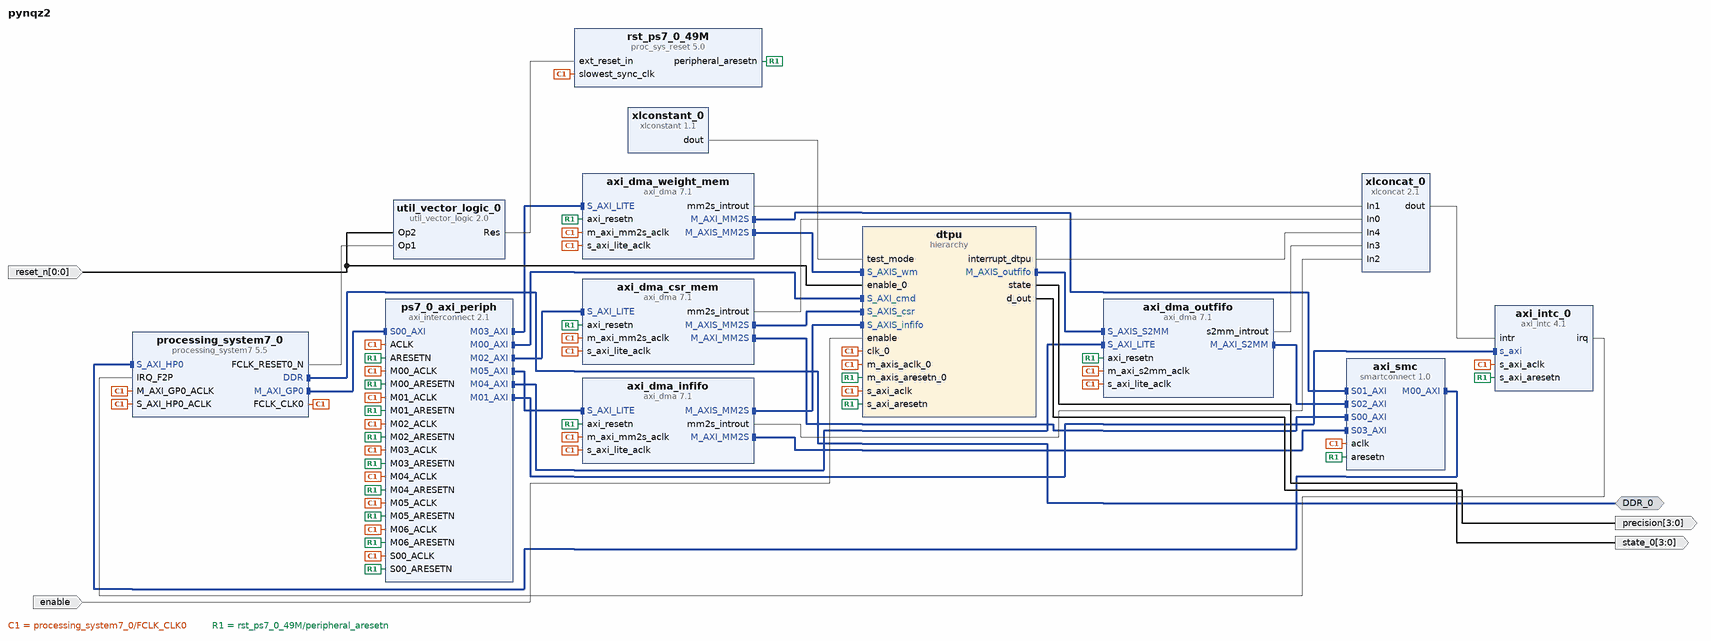
[diagram p0: block diagram of the top level]
# Vivado block design pynqz2, xc7z020clg400-1, Vivado 2019.2
create_bd_design pynqz2

create_bd_intf_port -mode Master -vlnv xilinx.com:interface:ddrx_rtl:1.0 DDR_0
create_bd_port -dir O -from 3 -to 0 state_0
create_bd_port -dir O -from 3 -to 0 precision
create_bd_port -dir I enable
create_bd_port -dir I -from 0 -to 0 reset_n

create_bd_cell -type ip -vlnv xilinx.com:ip:processing_system7:5.5 processing_system7_0
set_property -dict [list \
  CONFIG.PCW_APU_PERIPHERAL_FREQMHZ 650 \
  CONFIG.PCW_CRYSTAL_PERIPHERAL_FREQMHZ 50 \
  CONFIG.PCW_ENET0_ENET0_IO {MIO 16 .. 27} \
  CONFIG.PCW_ENET0_GRP_MDIO_ENABLE 1 \
  CONFIG.PCW_ENET0_GRP_MDIO_IO {MIO 52 .. 53} \
  CONFIG.PCW_ENET0_PERIPHERAL_ENABLE 1 \
  CONFIG.PCW_ENET0_RESET_ENABLE 1 \
  CONFIG.PCW_ENET0_RESET_IO {MIO 9} \
  CONFIG.PCW_ENET_RESET_ENABLE 1 \
  CONFIG.PCW_ENET_RESET_SELECT {Share reset pin} \
  CONFIG.PCW_FCLK_CLK0_BUF FALSE \
  CONFIG.PCW_FPGA0_PERIPHERAL_FREQMHZ 30 \
  CONFIG.PCW_FPGA1_PERIPHERAL_FREQMHZ 10 \
  CONFIG.PCW_FPGA2_PERIPHERAL_FREQMHZ 200 \
  CONFIG.PCW_FPGA3_PERIPHERAL_FREQMHZ 166.67 \
  CONFIG.PCW_GPIO_MIO_GPIO_ENABLE 1 \
  CONFIG.PCW_GPIO_MIO_GPIO_IO MIO \
  CONFIG.PCW_I2C_RESET_ENABLE 1 \
  CONFIG.PCW_IRQ_F2P_INTR 1 \
  CONFIG.PCW_PERIPHERAL_BOARD_PRESET part0 \
  CONFIG.PCW_PRESET_BANK1_VOLTAGE {LVCMOS 1.8V} \
  CONFIG.PCW_QSPI_GRP_FBCLK_ENABLE 1 \
  CONFIG.PCW_QSPI_GRP_FBCLK_IO {MIO 8} \
  CONFIG.PCW_QSPI_GRP_SINGLE_SS_ENABLE 1 \
  CONFIG.PCW_QSPI_GRP_SINGLE_SS_IO {MIO 1 .. 6} \
  CONFIG.PCW_QSPI_PERIPHERAL_ENABLE 1 \
  CONFIG.PCW_QSPI_QSPI_IO {MIO 1 .. 6} \
  CONFIG.PCW_SD0_GRP_CD_ENABLE 1 \
  CONFIG.PCW_SD0_GRP_CD_IO {MIO 47} \
  CONFIG.PCW_SD0_GRP_WP_ENABLE 0 \
  CONFIG.PCW_SD0_PERIPHERAL_ENABLE 1 \
  CONFIG.PCW_SD0_SD0_IO {MIO 40 .. 45} \
  CONFIG.PCW_SDIO_PERIPHERAL_FREQMHZ 50 \
  CONFIG.PCW_SINGLE_QSPI_DATA_MODE x4 \
  CONFIG.PCW_TTC0_PERIPHERAL_ENABLE 1 \
  CONFIG.PCW_TTC0_TTC0_IO EMIO \
  CONFIG.PCW_UART0_PERIPHERAL_ENABLE 1 \
  CONFIG.PCW_UART0_UART0_IO {MIO 14 .. 15} \
  CONFIG.PCW_UART1_PERIPHERAL_ENABLE 0 \
  CONFIG.PCW_UART_PERIPHERAL_FREQMHZ 100 \
  CONFIG.PCW_UIPARAM_DDR_BUS_WIDTH {16 Bit} \
  CONFIG.PCW_UIPARAM_DDR_FREQ_MHZ 525 \
  CONFIG.PCW_UIPARAM_DDR_PARTNO {MT41J256M16 RE-125} \
  CONFIG.PCW_USB0_PERIPHERAL_ENABLE 1 \
  CONFIG.PCW_USB0_RESET_ENABLE 1 \
  CONFIG.PCW_USB0_RESET_IO {MIO 46} \
  CONFIG.PCW_USB0_USB0_IO {MIO 28 .. 39} \
  CONFIG.PCW_USB_RESET_ENABLE 1 \
  CONFIG.PCW_USB_RESET_SELECT {Share reset pin} \
  CONFIG.PCW_USE_FABRIC_INTERRUPT 1 \
  CONFIG.PCW_USE_S_AXI_HP0 1 \
] [get_bd_cells processing_system7_0]
# 510 more settings of processing_system7_0 are not shown: defaults, MIO pin electricals, DDR timing, and values the tool derives
create_bd_cell -type ip -vlnv xilinx.com:ip:proc_sys_reset:5.0 rst_ps7_0_49M
create_bd_cell -type ip -vlnv xilinx.com:ip:xlconcat:2.1 xlconcat_0
set_property -dict {CONFIG.NUM_PORTS 5} [get_bd_cells xlconcat_0]
create_bd_cell -type hier dtpu
create_bd_cell -type ip -vlnv xilinx.com:ip:util_vector_logic:2.0 util_vector_logic_0
set_property -dict {CONFIG.C_SIZE 1} [get_bd_cells util_vector_logic_0]
create_bd_cell -type ip -vlnv xilinx.com:ip:axi_dma:7.1 axi_dma_csr_mem
set_property -dict [list \
  CONFIG.c_include_mm2s_dre 1 \
  CONFIG.c_include_s2mm 0 \
  CONFIG.c_include_sg 0 \
  CONFIG.c_m_axi_mm2s_data_width 64 \
  CONFIG.c_m_axis_mm2s_tdata_width 64 \
  CONFIG.c_mm2s_burst_size 8 \
  CONFIG.c_sg_length_width 26 \
] [get_bd_cells axi_dma_csr_mem]
create_bd_cell -type ip -vlnv xilinx.com:ip:axi_intc:4.1 axi_intc_0
set_property -dict {CONFIG.C_IRQ_CONNECTION 1} [get_bd_cells axi_intc_0]
create_bd_cell -type ip -vlnv xilinx.com:ip:smartconnect:1.0 axi_smc
set_property -dict {CONFIG.NUM_MI 1 CONFIG.NUM_SI 4} [get_bd_cells axi_smc]
create_bd_cell -type ip -vlnv xilinx.com:ip:axi_interconnect:2.1 ps7_0_axi_periph
set_property -dict {CONFIG.NUM_MI 7} [get_bd_cells ps7_0_axi_periph]
create_bd_cell -type ip -vlnv xilinx.com:ip:xlconstant:1.1 xlconstant_0
set_property -dict {CONFIG.CONST_VAL 0} [get_bd_cells xlconstant_0]
create_bd_cell -type ip -vlnv xilinx.com:ip:axi_dma:7.1 axi_dma_weight_mem
set_property -dict [list \
  CONFIG.c_include_mm2s_dre 1 \
  CONFIG.c_include_s2mm 0 \
  CONFIG.c_include_sg 0 \
  CONFIG.c_m_axi_mm2s_data_width 64 \
  CONFIG.c_m_axis_mm2s_tdata_width 64 \
  CONFIG.c_mm2s_burst_size 8 \
  CONFIG.c_sg_length_width 26 \
] [get_bd_cells axi_dma_weight_mem]
create_bd_cell -type ip -vlnv xilinx.com:ip:axi_dma:7.1 axi_dma_outfifo
set_property -dict [list \
  CONFIG.c_include_mm2s 0 \
  CONFIG.c_include_s2mm_dre 1 \
  CONFIG.c_include_sg 0 \
  CONFIG.c_sg_length_width 20 \
] [get_bd_cells axi_dma_outfifo]
create_bd_cell -type ip -vlnv xilinx.com:ip:axi_dma:7.1 axi_dma_infifo
set_property -dict [list \
  CONFIG.c_include_mm2s_dre 1 \
  CONFIG.c_include_s2mm 0 \
  CONFIG.c_include_sg 0 \
  CONFIG.c_m_axi_mm2s_data_width 64 \
  CONFIG.c_m_axis_mm2s_tdata_width 64 \
  CONFIG.c_mm2s_burst_size 8 \
  CONFIG.c_sg_length_width 20 \
] [get_bd_cells axi_dma_infifo]

# ---- hierarchy /dtpu ----
current_bd_instance /dtpu
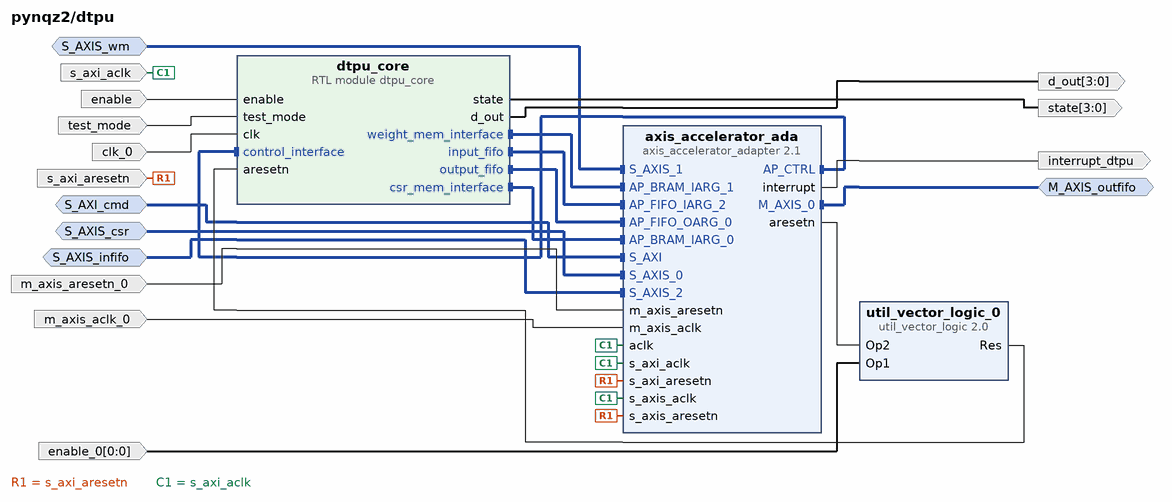
[diagram p1: block diagram inside /dtpu]
create_bd_intf_pin -mode Slave -vlnv xilinx.com:interface:axis_rtl:1.0 S_AXIS_infifo
create_bd_intf_pin -mode Slave -vlnv xilinx.com:interface:axis_rtl:1.0 S_AXIS_wm
create_bd_intf_pin -mode Slave -vlnv xilinx.com:interface:axis_rtl:1.0 S_AXIS_csr
create_bd_intf_pin -mode Master -vlnv xilinx.com:interface:axis_rtl:1.0 M_AXIS_outfifo
create_bd_intf_pin -mode Slave -vlnv xilinx.com:interface:aximm_rtl:1.0 S_AXI_cmd
create_bd_pin -dir O -from 3 -to 0 state
create_bd_pin -dir O -from 3 -to 0 d_out
create_bd_pin -dir I enable
create_bd_pin -dir I test_mode
create_bd_pin -dir I -from 0 -to 0 enable_0
create_bd_pin -dir I -type clk clk_0
create_bd_pin -dir O -type intr interrupt_dtpu
create_bd_pin -dir I -type rst s_axi_aresetn
create_bd_pin -dir I -type clk s_axi_aclk
create_bd_pin -dir I -type rst m_axis_aresetn_0
create_bd_pin -dir I -type clk m_axis_aclk_0

create_bd_cell -type ip -vlnv xilinx.com:ip:util_vector_logic:2.0 util_vector_logic_0
set_property -dict {CONFIG.C_SIZE 1} [get_bd_cells util_vector_logic_0]
create_bd_cell -type module -reference dtpu_core dtpu_core
set_property -dict {CONFIG.COLUMNS 8 CONFIG.DATA_WIDTH_CSR 64 CONFIG.ROWS 8 CONFIG.SIZE_WMEMORY 16384} [get_bd_cells dtpu_core]
create_bd_cell -type ip -vlnv xilinx.com:ip:axis_accelerator_adapter:2.1 axis_accelerator_ada
set_property -dict [list \
  CONFIG.C_AP_ADAPTER_ID 0 \
  CONFIG.C_AP_IARG_0_DWIDTH 64 \
  CONFIG.C_AP_IARG_0_MB_DEPTH 2 \
  CONFIG.C_AP_IARG_1_DIM_1 16384 \
  CONFIG.C_AP_IARG_1_DWIDTH 64 \
  CONFIG.C_AP_IARG_1_MB_DEPTH 2 \
  CONFIG.C_AP_IARG_2_DIM_1 2048 \
  CONFIG.C_AP_IARG_2_DWIDTH 64 \
  CONFIG.C_AP_IARG_2_TYPE 1 \
  CONFIG.C_AP_OARG_0_DIM_1 2048 \
  CONFIG.C_AP_OARG_0_DWIDTH 64 \
  CONFIG.C_AP_OARG_0_TYPE 1 \
  CONFIG.C_IARG_HAS_BRAM 1 \
  CONFIG.C_IARG_HAS_FIFO 1 \
  CONFIG.C_M_AXIS_HAS_TKEEP 1 \
  CONFIG.C_M_AXIS_TDEST_WIDTH 0 \
  CONFIG.C_M_AXIS_TID_WIDTH 0 \
  CONFIG.C_M_AXIS_TUSER_WIDTH 0 \
  CONFIG.C_N_INPUT_ARGS 3 \
  CONFIG.C_OARG_HAS_BRAM 0 \
  CONFIG.C_OARG_HAS_FIFO 1 \
] [get_bd_cells axis_accelerator_ada]

# ---- connections ----

current_bd_instance /dtpu
connect_bd_intf_net -intf_net axis_accelerator_ada_0_AP_CTRL [get_bd_intf_pins dtpu_core/control_interface] [get_bd_intf_pins axis_accelerator_ada/AP_CTRL]
connect_bd_intf_net [get_bd_intf_pins S_AXIS_wm] [get_bd_intf_pins axis_accelerator_ada/S_AXIS_1]
connect_bd_intf_net [get_bd_intf_pins S_AXI_cmd] [get_bd_intf_pins axis_accelerator_ada/S_AXI]
connect_bd_intf_net [get_bd_intf_pins M_AXIS_outfifo] [get_bd_intf_pins axis_accelerator_ada/M_AXIS_0]
connect_bd_intf_net [get_bd_intf_pins S_AXIS_csr] [get_bd_intf_pins axis_accelerator_ada/S_AXIS_0]
connect_bd_intf_net [get_bd_intf_pins dtpu_core/weight_mem_interface] [get_bd_intf_pins axis_accelerator_ada/AP_BRAM_IARG_1]
connect_bd_intf_net [get_bd_intf_pins dtpu_core/input_fifo] [get_bd_intf_pins axis_accelerator_ada/AP_FIFO_IARG_2]
connect_bd_intf_net [get_bd_intf_pins dtpu_core/output_fifo] [get_bd_intf_pins axis_accelerator_ada/AP_FIFO_OARG_0]
connect_bd_intf_net [get_bd_intf_pins dtpu_core/csr_mem_interface] [get_bd_intf_pins axis_accelerator_ada/AP_BRAM_IARG_0]
connect_bd_intf_net [get_bd_intf_pins S_AXIS_infifo] [get_bd_intf_pins axis_accelerator_ada/S_AXIS_2]
connect_bd_net [get_bd_pins dtpu_core/state] [get_bd_pins state]
connect_bd_net [get_bd_pins dtpu_core/d_out] [get_bd_pins d_out]
connect_bd_net -net enable_0_1 [get_bd_pins enable] [get_bd_pins dtpu_core/enable]
connect_bd_net [get_bd_pins test_mode] [get_bd_pins dtpu_core/test_mode]
connect_bd_net [get_bd_pins util_vector_logic_0/Res] [get_bd_pins dtpu_core/aresetn]
connect_bd_net -net Op1_0_1 [get_bd_pins enable_0] [get_bd_pins util_vector_logic_0/Op1]
connect_bd_net -net clk_0_1 [get_bd_pins clk_0] [get_bd_pins dtpu_core/clk]
connect_bd_net -net axis_accelerator_ada_0_interrupt [get_bd_pins axis_accelerator_ada/interrupt] [get_bd_pins interrupt_dtpu]
connect_bd_net -net axis_accelerator_ada_0_aresetn [get_bd_pins axis_accelerator_ada/aresetn] [get_bd_pins util_vector_logic_0/Op2]
connect_bd_net [get_bd_pins s_axi_aresetn] [get_bd_pins axis_accelerator_ada/s_axi_aresetn] [get_bd_pins axis_accelerator_ada/s_axis_aresetn]
connect_bd_net [get_bd_pins s_axi_aclk] \
  [get_bd_pins axis_accelerator_ada/s_axi_aclk] [get_bd_pins axis_accelerator_ada/aclk] \
  [get_bd_pins axis_accelerator_ada/s_axis_aclk]
connect_bd_net -net m_axis_aresetn_0_1 [get_bd_pins m_axis_aresetn_0] [get_bd_pins axis_accelerator_ada/m_axis_aresetn]
connect_bd_net -net m_axis_aclk_0_1 [get_bd_pins m_axis_aclk_0] [get_bd_pins axis_accelerator_ada/m_axis_aclk]

current_bd_instance /
connect_bd_intf_net [get_bd_intf_pins ps7_0_axi_periph/M05_AXI] [get_bd_intf_pins axi_dma_infifo/S_AXI_LITE]
connect_bd_intf_net [get_bd_intf_pins axi_dma_weight_mem/M_AXIS_MM2S] [get_bd_intf_pins dtpu/S_AXIS_wm]
connect_bd_intf_net [get_bd_intf_pins ps7_0_axi_periph/M03_AXI] [get_bd_intf_pins axi_dma_weight_mem/S_AXI_LITE]
connect_bd_intf_net [get_bd_intf_pins ps7_0_axi_periph/M00_AXI] [get_bd_intf_pins dtpu/S_AXI_cmd]
connect_bd_intf_net [get_bd_intf_ports DDR_0] [get_bd_intf_pins processing_system7_0/DDR]
connect_bd_intf_net [get_bd_intf_pins axi_dma_infifo/M_AXI_MM2S] [get_bd_intf_pins axi_smc/S03_AXI]
connect_bd_intf_net [get_bd_intf_pins axi_dma_weight_mem/M_AXI_MM2S] [get_bd_intf_pins axi_smc/S01_AXI]
connect_bd_intf_net -intf_net dtpu_M_AXIS_0 [get_bd_intf_pins axi_dma_outfifo/S_AXIS_S2MM] [get_bd_intf_pins dtpu/M_AXIS_outfifo]
connect_bd_intf_net [get_bd_intf_pins axi_dma_outfifo/M_AXI_S2MM] [get_bd_intf_pins axi_smc/S02_AXI]
connect_bd_intf_net [get_bd_intf_pins axi_smc/M00_AXI] [get_bd_intf_pins processing_system7_0/S_AXI_HP0]
connect_bd_intf_net [get_bd_intf_pins axi_dma_csr_mem/M_AXIS_MM2S] [get_bd_intf_pins dtpu/S_AXIS_csr]
connect_bd_intf_net [get_bd_intf_pins axi_dma_infifo/M_AXIS_MM2S] [get_bd_intf_pins dtpu/S_AXIS_infifo]
connect_bd_intf_net [get_bd_intf_pins ps7_0_axi_periph/M02_AXI] [get_bd_intf_pins axi_dma_csr_mem/S_AXI_LITE]
connect_bd_intf_net [get_bd_intf_pins axi_dma_csr_mem/M_AXI_MM2S] [get_bd_intf_pins axi_smc/S00_AXI]
connect_bd_intf_net [get_bd_intf_pins processing_system7_0/M_AXI_GP0] [get_bd_intf_pins ps7_0_axi_periph/S00_AXI]
connect_bd_intf_net [get_bd_intf_pins ps7_0_axi_periph/M01_AXI] [get_bd_intf_pins axi_intc_0/s_axi]
connect_bd_intf_net [get_bd_intf_pins ps7_0_axi_periph/M04_AXI] [get_bd_intf_pins axi_dma_outfifo/S_AXI_LITE]
connect_bd_net [get_bd_pins xlconcat_0/dout] [get_bd_pins axi_intc_0/intr]
connect_bd_net [get_bd_pins axi_intc_0/irq] [get_bd_pins processing_system7_0/IRQ_F2P]
connect_bd_net [get_bd_pins processing_system7_0/FCLK_CLK0] \
  [get_bd_pins processing_system7_0/M_AXI_GP0_ACLK] [get_bd_pins rst_ps7_0_49M/slowest_sync_clk] \
  [get_bd_pins processing_system7_0/S_AXI_HP0_ACLK] [get_bd_pins dtpu/clk_0] [get_bd_pins axi_dma_csr_mem/s_axi_lite_aclk] \
  [get_bd_pins axi_dma_csr_mem/m_axi_mm2s_aclk] [get_bd_pins axi_intc_0/s_axi_aclk] [get_bd_pins axi_smc/aclk] \
  [get_bd_pins ps7_0_axi_periph/ACLK] [get_bd_pins ps7_0_axi_periph/S00_ACLK] [get_bd_pins ps7_0_axi_periph/M00_ACLK] \
  [get_bd_pins ps7_0_axi_periph/M01_ACLK] [get_bd_pins ps7_0_axi_periph/M02_ACLK] [get_bd_pins ps7_0_axi_periph/M03_ACLK] \
  [get_bd_pins ps7_0_axi_periph/M04_ACLK] [get_bd_pins ps7_0_axi_periph/M05_ACLK] [get_bd_pins ps7_0_axi_periph/M06_ACLK] \
  [get_bd_pins axi_dma_weight_mem/s_axi_lite_aclk] [get_bd_pins axi_dma_weight_mem/m_axi_mm2s_aclk] \
  [get_bd_pins axi_dma_outfifo/s_axi_lite_aclk] [get_bd_pins axi_dma_outfifo/m_axi_s2mm_aclk] \
  [get_bd_pins axi_dma_infifo/s_axi_lite_aclk] [get_bd_pins axi_dma_infifo/m_axi_mm2s_aclk] [get_bd_pins dtpu/s_axi_aclk] \
  [get_bd_pins dtpu/m_axis_aclk_0]
connect_bd_net [get_bd_pins rst_ps7_0_49M/peripheral_aresetn] \
  [get_bd_pins axi_dma_csr_mem/axi_resetn] [get_bd_pins axi_intc_0/s_axi_aresetn] [get_bd_pins axi_smc/aresetn] \
  [get_bd_pins ps7_0_axi_periph/ARESETN] [get_bd_pins ps7_0_axi_periph/S00_ARESETN] \
  [get_bd_pins ps7_0_axi_periph/M00_ARESETN] [get_bd_pins ps7_0_axi_periph/M01_ARESETN] \
  [get_bd_pins ps7_0_axi_periph/M02_ARESETN] [get_bd_pins ps7_0_axi_periph/M03_ARESETN] \
  [get_bd_pins ps7_0_axi_periph/M04_ARESETN] [get_bd_pins ps7_0_axi_periph/M05_ARESETN] \
  [get_bd_pins ps7_0_axi_periph/M06_ARESETN] [get_bd_pins axi_dma_weight_mem/axi_resetn] \
  [get_bd_pins axi_dma_outfifo/axi_resetn] [get_bd_pins axi_dma_infifo/axi_resetn] [get_bd_pins dtpu/s_axi_aresetn] \
  [get_bd_pins dtpu/m_axis_aresetn_0]
connect_bd_net [get_bd_pins axi_dma_csr_mem/mm2s_introut] [get_bd_pins xlconcat_0/In0]
connect_bd_net [get_bd_pins axi_dma_weight_mem/mm2s_introut] [get_bd_pins xlconcat_0/In1]
connect_bd_net [get_bd_pins axi_dma_infifo/mm2s_introut] [get_bd_pins xlconcat_0/In2]
connect_bd_net [get_bd_pins axi_dma_outfifo/s2mm_introut] [get_bd_pins xlconcat_0/In3]
connect_bd_net [get_bd_pins dtpu/state] [get_bd_ports state_0]
connect_bd_net [get_bd_pins dtpu/d_out] [get_bd_ports precision]
connect_bd_net [get_bd_pins util_vector_logic_0/Res] [get_bd_pins rst_ps7_0_49M/ext_reset_in]
connect_bd_net [get_bd_pins processing_system7_0/FCLK_RESET0_N] [get_bd_pins util_vector_logic_0/Op1]
connect_bd_net -net enable_0_1 [get_bd_ports enable] [get_bd_pins dtpu/enable]
connect_bd_net [get_bd_pins xlconstant_0/dout] [get_bd_pins dtpu/test_mode]
connect_bd_net -net Op1_0_1 [get_bd_ports reset_n] [get_bd_pins dtpu/enable_0] [get_bd_pins util_vector_logic_0/Op2]
connect_bd_net -net dtpu_interrupt [get_bd_pins dtpu/interrupt_dtpu] [get_bd_pins xlconcat_0/In4]

# ---- address map ----
assign_bd_address -offset 0x00000000 -range 512M -target_address_space [get_bd_addr_spaces axi_dma_csr_mem/Data_MM2S] [get_bd_addr_segs processing_system7_0/S_AXI_HP0/HP0_DDR_LOWOCM]
assign_bd_address -offset 0x00000000 -range 512M -target_address_space [get_bd_addr_spaces axi_dma_infifo/Data_MM2S] [get_bd_addr_segs processing_system7_0/S_AXI_HP0/HP0_DDR_LOWOCM]
assign_bd_address -offset 0x00000000 -range 512M -target_address_space [get_bd_addr_spaces axi_dma_outfifo/Data_S2MM] [get_bd_addr_segs processing_system7_0/S_AXI_HP0/HP0_DDR_LOWOCM]
assign_bd_address -offset 0x00000000 -range 512M -target_address_space [get_bd_addr_spaces axi_dma_weight_mem/Data_MM2S] [get_bd_addr_segs processing_system7_0/S_AXI_HP0/HP0_DDR_LOWOCM]
assign_bd_address -offset 0x40400000 -range 64K -target_address_space [get_bd_addr_spaces processing_system7_0/Data] [get_bd_addr_segs axi_dma_csr_mem/S_AXI_LITE/Reg]
assign_bd_address -offset 0x40410000 -range 64K -target_address_space [get_bd_addr_spaces processing_system7_0/Data] [get_bd_addr_segs axi_dma_weight_mem/S_AXI_LITE/Reg]
assign_bd_address -offset 0x40420000 -range 64K -target_address_space [get_bd_addr_spaces processing_system7_0/Data] [get_bd_addr_segs axi_dma_outfifo/S_AXI_LITE/Reg]
assign_bd_address -offset 0x40430000 -range 64K -target_address_space [get_bd_addr_spaces processing_system7_0/Data] [get_bd_addr_segs axi_dma_infifo/S_AXI_LITE/Reg]
assign_bd_address -offset 0x41800000 -range 64K -target_address_space [get_bd_addr_spaces processing_system7_0/Data] [get_bd_addr_segs axi_intc_0/S_AXI/Reg]
assign_bd_address -offset 0x43C00000 -range 64K -target_address_space [get_bd_addr_spaces processing_system7_0/Data] [get_bd_addr_segs dtpu/axis_accelerator_ada/S_AXI/Reg]

validate_bd_design
save_bd_design
